# EAGLE design OpenRetroMGB.cart (EAGLE 9.6.2)
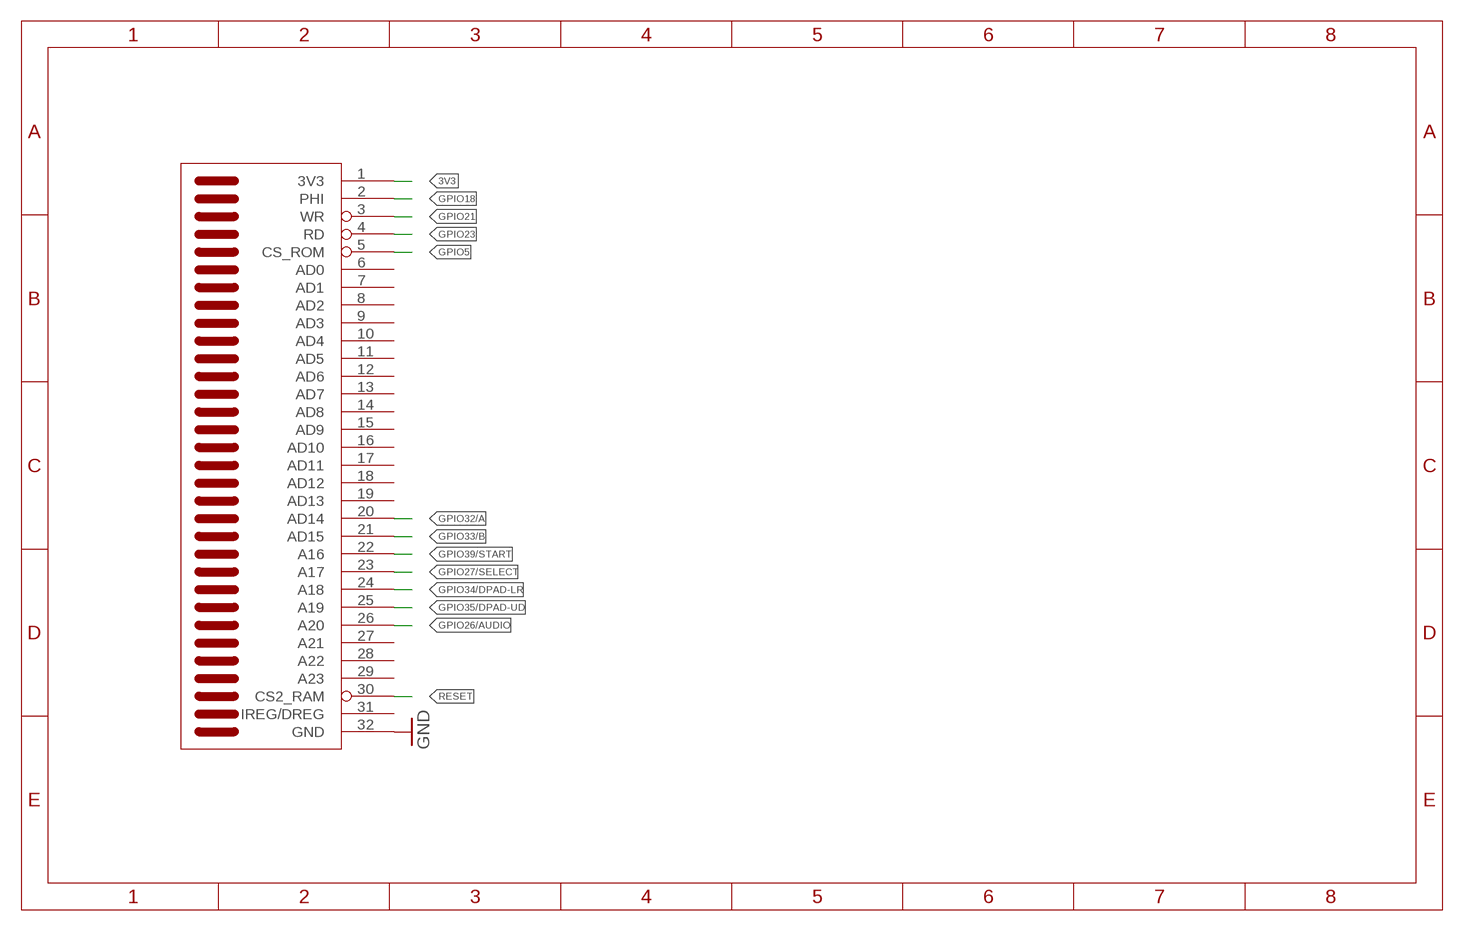
[diagram p0: schematic, sheet 1]

## Parts
U$2  GBA_CARTLARGE  [GBCART]

## Nets
3V3: U$2.1(3V3)
GND: U$2.32(GND)
GPIO5: U$2.5(CS_ROM)
GPIO18: U$2.2(PHI)
GPIO21: U$2.3(WR)
GPIO23: U$2.4(RD)
GPIO26/AUDIO: U$2.26(A20)
GPIO27/SELECT: U$2.23(A17)
GPIO32/A: U$2.20(AD14)
GPIO33/B: U$2.21(AD15)
GPIO34/DPAD-LR: U$2.24(A18)
GPIO35/DPAD-UD: U$2.25(A19)
GPIO39/START: U$2.22(A16)
RESET: U$2.30(CS2_RAM)
Unconnected: U$2.6(AD0) U$2.7(AD1) U$2.8(AD2) U$2.9(AD3) U$2.10(AD4) U$2.11(AD5) U$2.12(AD6) U$2.13(AD7) U$2.14(AD8) U$2.15(AD9) U$2.16(AD10) U$2.17(AD11) U$2.18(AD12) U$2.19(AD13) U$2.27(A21) U$2.28(A22) U$2.29(A23) U$2.31(IREG/DREG)

## Library data of the parts
U$2 = gameboy:GBA_CART

## Board
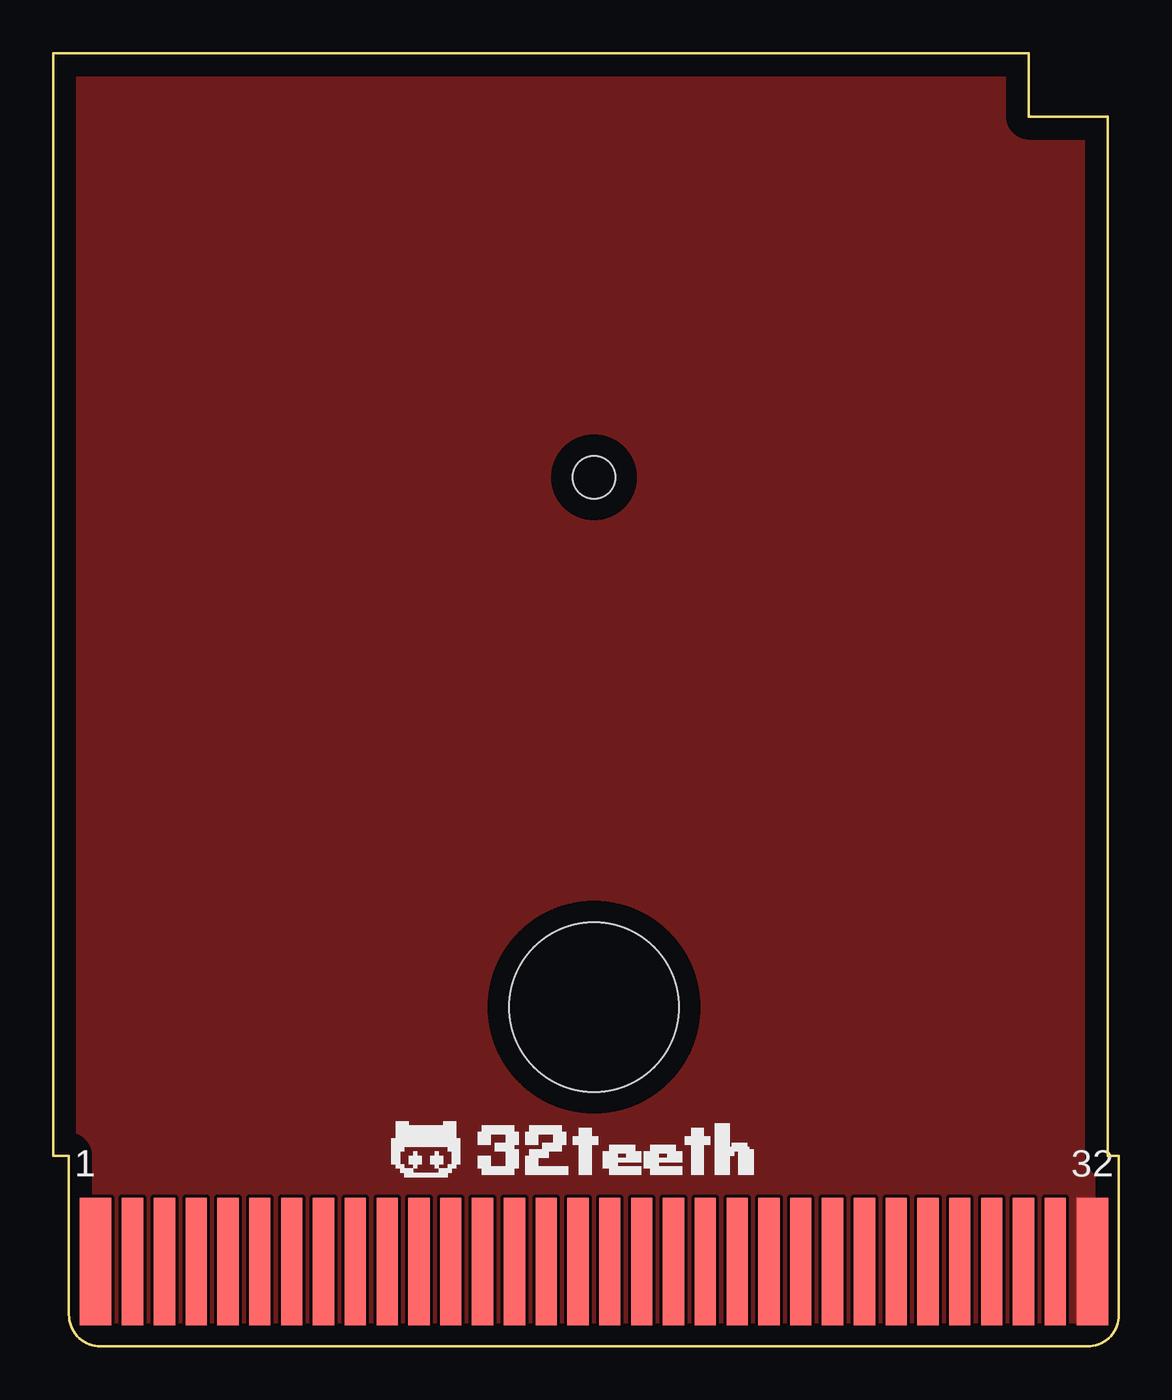
[diagram p1: board, top side]
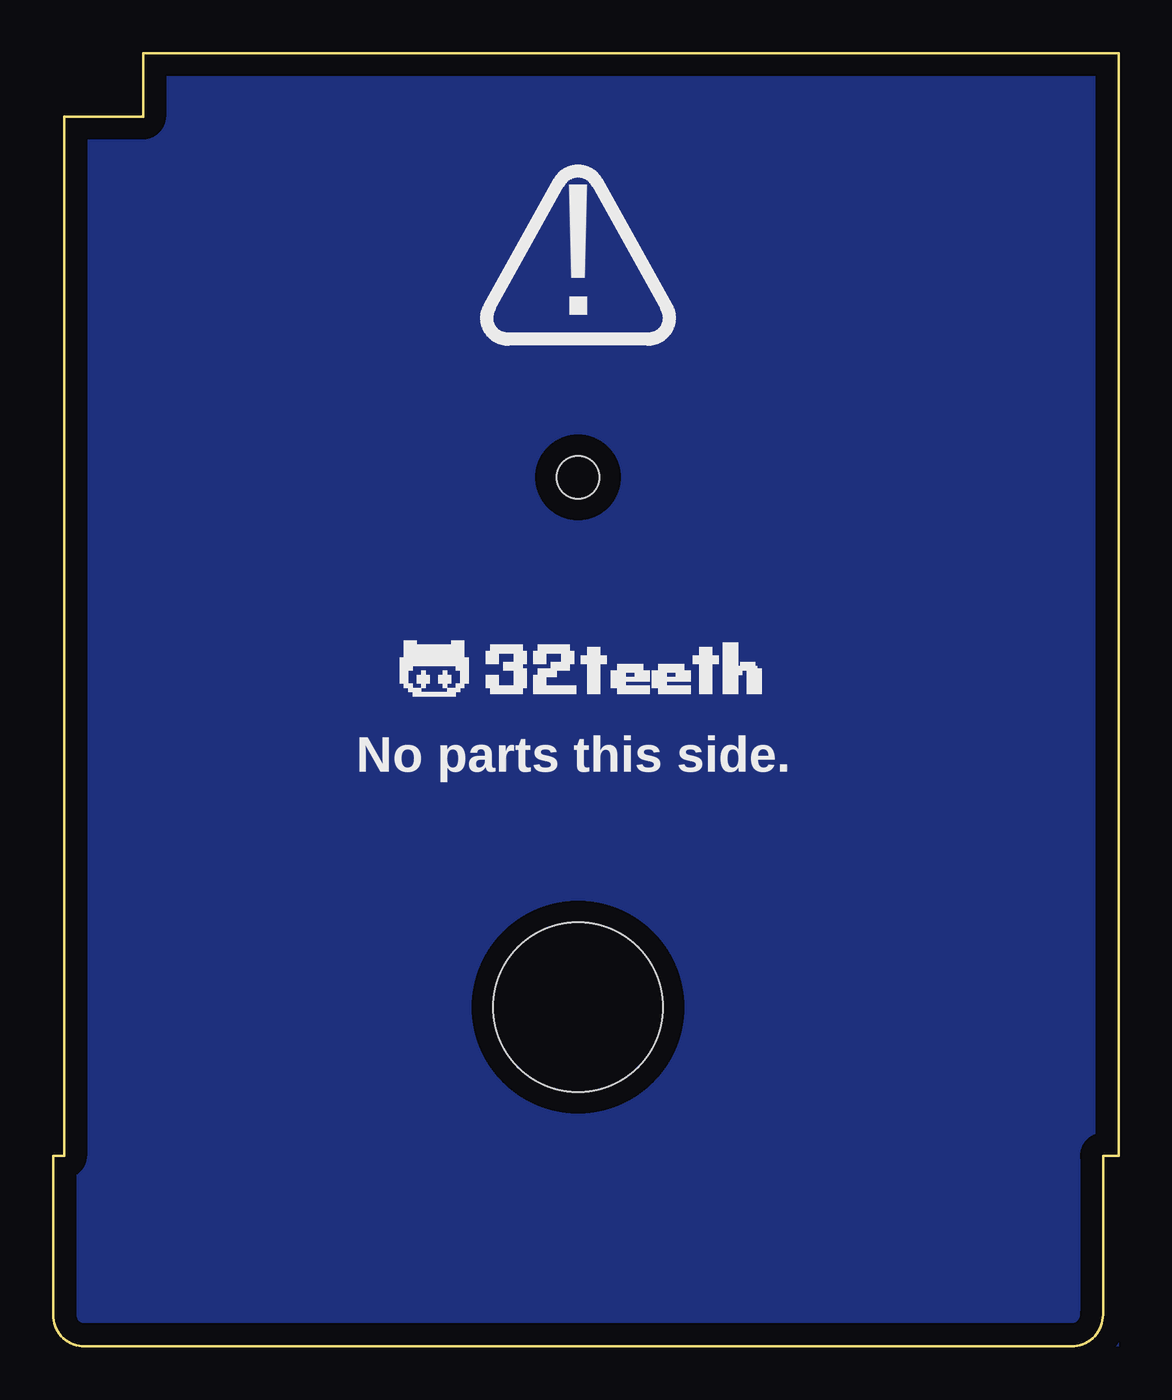
[diagram p2: board, bottom side, seen from below]

Size 50.25 x 61 mm. Coordinates in mm from the lower left corner, seen from the top.
Copper layers (1*16): Top 0.035mm / dielectric 1.5mm / Bottom 0.035mm
Design rules "default": minimum track width 6mil, minimum drill 0.35mm, track to track 6mil, track to pad 6mil, pad to pad 6mil, via to via 6mil, smd to smd 6mil, copper to edge 40mil, drill to drill 6mil, minimum pad ring 10mil, minimum via ring 8mil, stop-mask expansion 4mil, vias tented up to drill 0mil, thermal gap 10mil

### Footprints (pad centres in the part's own frame; a part is rotated, then mirrored left to right if it is on the bottom)
GBCART = smd 1.5 x 6: 1 2,4; 32 49,4 | smd 1 x 6: 2 3.75,4; 3 5.25,4; 4 6.75,4; 5 8.25,4; 6 9.75,4; 7 11.25,4; 8 12.75,4; 9 14.25,4; 10 15.75,4; 11 17.25,4; 12 18.75,4; 13 20.25,4; 14 21.75,4; 15 23.25,4; 16 24.75,4; 17 26.25,4; 18 27.75,4; 19 29.25,4; 20 30.75,4; 21 32.25,4; 22 33.75,4; 23 35.25,4; 24 36.75,4; 25 38.25,4; 26 39.75,4; 27 41.25,4; 28 42.75,4; 29 44.25,4; 30 45.75,4; 31 47.25,4 | hole 8: 25.5,16 | hole 2: 25.5,41

### Placement (x,y rotation side)
U$2  0,0 0 top

### Tracks (layer width: path | path; a pad name or v marks a point on that pad's centre or on a via)
GND
  pour Top (rank 2, no thermals): 0,0 49.75,0 49.75,58 46,58 46,61 0,61
  pour Bottom (no thermals): 0,0 0,61 46,61 46,58 49.75,58 49.75,0